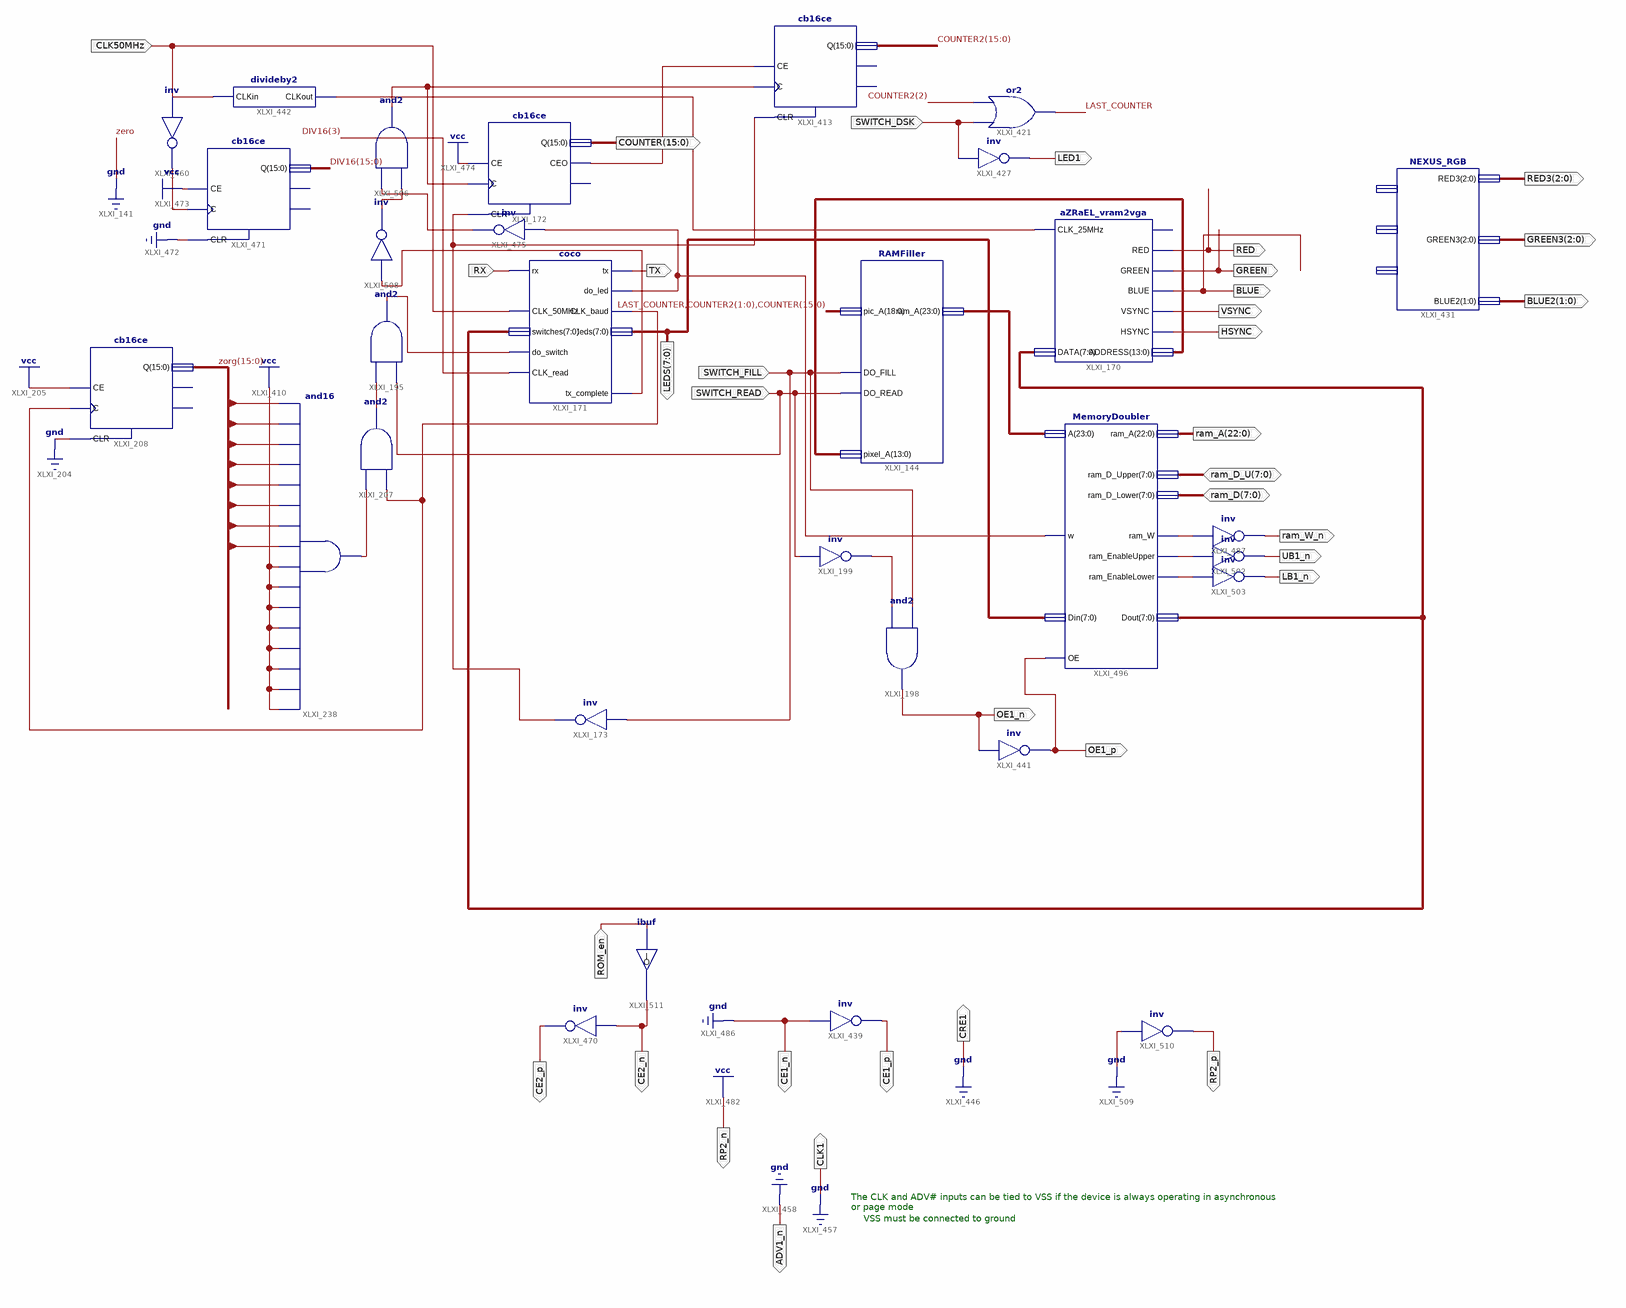
[diagram p0: schematic sheet 1]
// Xilinx ISE schematic externalVRAM2VGA_2.sch (spartan3e) as structural Verilog: 30 symbols, 35 ports
module externalVRAM2VGA_2 (
  input  CLK50MHz,
  input  SWITCH_FILL,
  input  SWITCH_READ,
  input  RX,
  input  SWITCH_DSK,
  input  ROM_en,
  inout  [7:0] ram_D,
  inout  [7:0] ram_D_U,
  output [7:0] LEDS,
  output TX,
  output RED,
  output GREEN,
  output BLUE,
  output VSYNC,
  output HSYNC,
  output [15:0] COUNTER,
  output OE1_n,
  output LED1,
  output [2:0] RED3,
  output [2:0] GREEN3,
  output [1:0] BLUE2,
  output [22:0] ram_A,
  output ram_W_n,
  output LB1_n,
  output UB1_n,
  output CRE1,
  output ADV1_n,
  output CLK1,
  output CE2_p,
  output CE1_p,
  output RP2_n,
  output CE1_n,
  output CE2_n,
  output OE1_p,
  output RP2_p
);

  wire LAST_COUNTER, ram_W_p, XLXN_618, XLXN_622, XLXN_926, XLXN_927, XLXN_986, XLXN_987, XLXN_1023,
       XLXN_1025, XLXN_1035, XLXN_1039, XLXN_1057, XLXN_1058, XLXN_1081, XLXN_1083, XLXN_1087, XLXN_1088;
  wire [7:0] XLXN_1020;
  wire [13:0] XLXN_1080;
  wire [15:0] COUNTER2, DIV16, zorg;
  wire [23:0] XLXN_1045;

  cb16ce XLXI_172 (.C(XLXN_1083), .CE(1'b1), .CLR(XLXN_987), .CEO(XLXN_986), .Q(COUNTER));  // open: TC
  not XLXI_173 (XLXN_987, SWITCH_FILL);
  and XLXI_207 (XLXN_618, XLXN_926, XLXN_927);
  and XLXI_238 (XLXN_927, 1'b1, 1'b1, 1'b1, 1'b1, 1'b1, 1'b1, 1'b1, 1'b1, zorg[7], zorg[6], zorg[5], zorg[4], zorg[3], zorg[2], zorg[1], zorg[0]);
  cb16ce XLXI_208 (.C(XLXN_926), .CE(1'b1), .CLR(1'b0), .Q(zorg));  // open: CEO, TC
  and XLXI_195 (XLXN_1039, SWITCH_READ, XLXN_618);
  coco XLXI_171 (
    .rx(RX), .do_switch(XLXN_1039), .CLK_50MHz(CLK50MHz), .CLK_read(DIV16[3]), .switches(XLXN_1020), .tx(TX),
    .do_led(XLXN_1035), .CLK_baud(XLXN_926), .leds(LEDS), .tx_complete(XLXN_1087));
  RAMFiller XLXI_144 (
    .DO_FILL(SWITCH_FILL), .DO_READ(SWITCH_READ), .pic_A({LAST_COUNTER, COUNTER2[1:0], COUNTER}),
    .pixel_A(XLXN_1080), .ram_A(XLXN_1045));
  aZRaEL_vram2vga XLXI_170 (
    .CLK_25MHz(XLXN_1023), .DATA(XLXN_1020), .RED(RED), .GREEN(GREEN), .BLUE(BLUE), .VSYNC(VSYNC),
    .HSYNC(HSYNC), .ADDRESS(XLXN_1080));  // open: R
  cb16ce XLXI_413 (.C(XLXN_1083), .CE(XLXN_986), .CLR(XLXN_987), .Q(COUNTER2));  // open: CEO, TC
  and XLXI_198 (OE1_n, XLXN_622, SWITCH_FILL);
  not XLXI_199 (XLXN_622, SWITCH_READ);
  or XLXI_421 (LAST_COUNTER, SWITCH_DSK, COUNTER2[2]);
  not XLXI_427 (LED1, SWITCH_DSK);
  NEXUS_RGB XLXI_431 (.RED3(RED3), .GREEN3(GREEN3), .BLUE2(BLUE2));  // open: RED_FF, GREEN_FF, BLUE_FF
  divideby2 XLXI_442 (.CLKin(CLK50MHz), .CLKout(XLXN_1023));
  not XLXI_460 (XLXN_1025, CLK50MHz);
  cb16ce XLXI_471 (.C(XLXN_1025), .CE(1'b1), .CLR(1'b0), .Q(DIV16));  // open: CEO, TC
  not XLXI_475 (XLXN_1081, XLXN_1035);
  MemoryDoubler XLXI_496 (
    .OE(OE1_p), .w(XLXN_1035), .A(XLXN_1045), .Din(LEDS), .ram_D_Upper(ram_D_U), .ram_D_Lower(ram_D),
    .ram_W(ram_W_p), .ram_EnableUpper(XLXN_1057), .ram_EnableLower(XLXN_1058), .Dout(XLXN_1020), .ram_A(ram_A));
  not XLXI_487 (ram_W_n, ram_W_p);
  not XLXI_502 (UB1_n, XLXN_1057);
  not XLXI_503 (LB1_n, XLXN_1058);
  not XLXI_470 (CE2_p, CE2_n);
  not XLXI_439 (CE1_p, 1'b0);
  not XLXI_441 (OE1_p, OE1_n);
  and XLXI_506 (XLXN_1083, XLXN_1088, XLXN_1081);
  not XLXI_508 (XLXN_1088, XLXN_1087);
  not XLXI_510 (RP2_p, 1'b0);
  ibuf XLXI_511 (.I(ROM_en), .O(CE2_n));

  assign ADV1_n = 1'b0;
  assign CE1_n = 1'b0;
  assign CLK1 = 1'b0;
  assign CRE1 = 1'b0;
  assign RP2_n = 1'b1;

  // Notes on the sheet:
  //   The CLK and ADV# inputs can be tied to VSS if the device is always operating in asynchronous                                                              
  //   or page mode
  //   VSS must be connected to ground
endmodule
